# Altium schematic sheet MCU Power.SchDoc: MCU Power
size A4; SheetNumber: 4; SheetTotal: 5
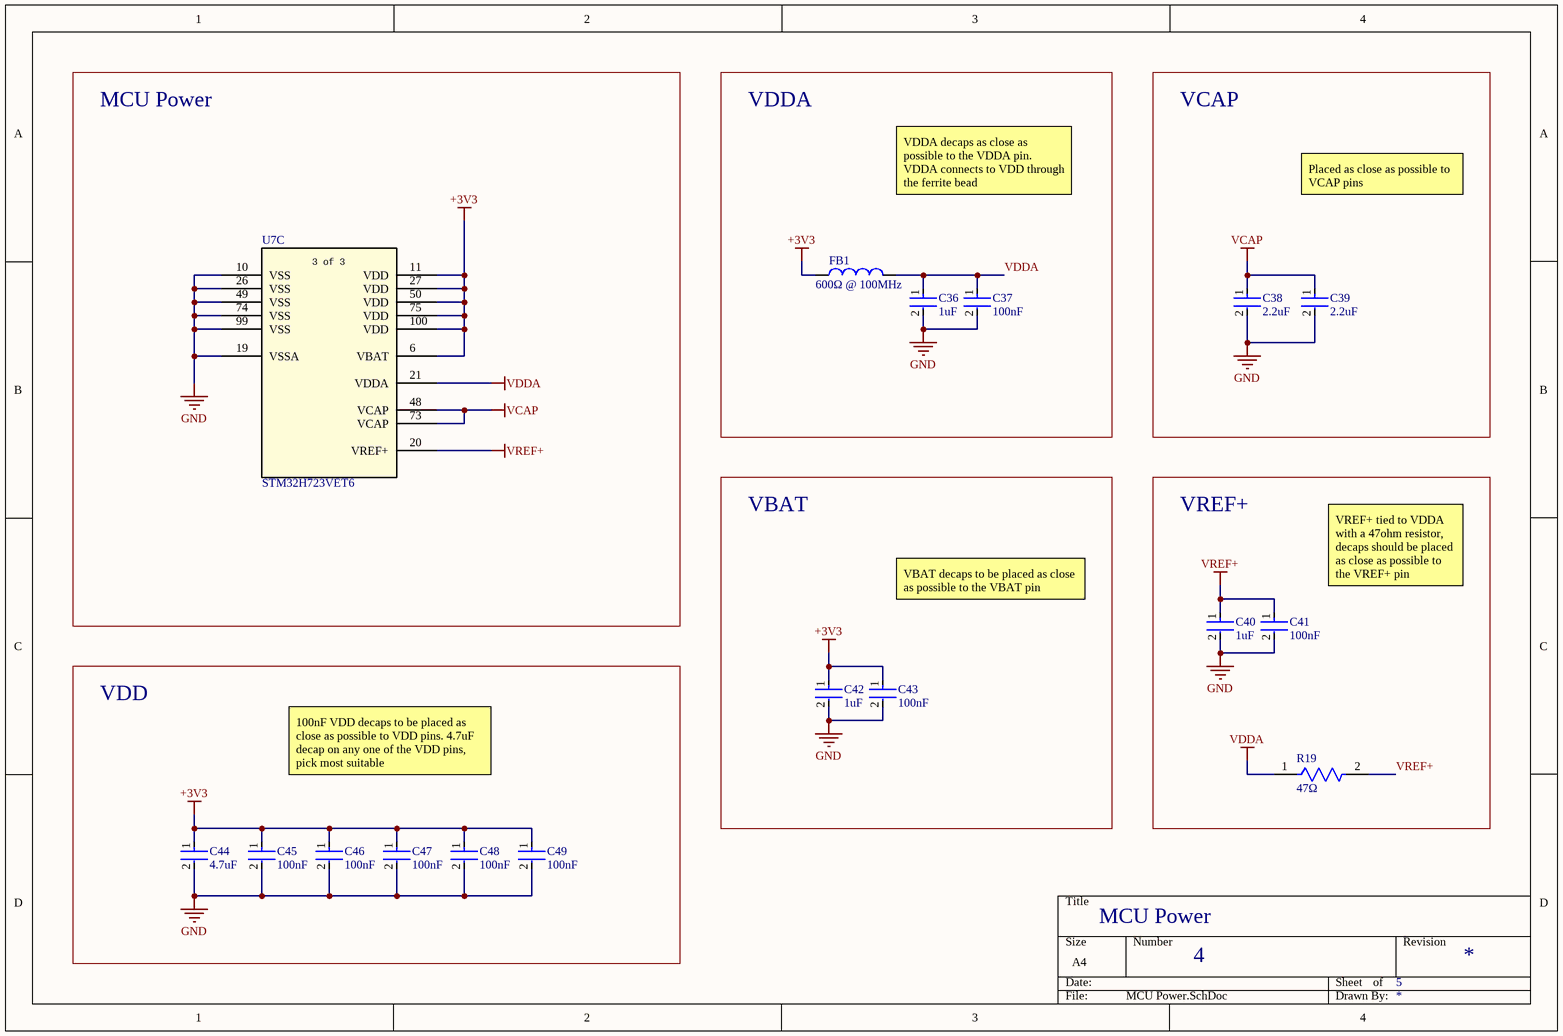
[diagram p0: MCU Power.SchDoc]

## Parts
C36  1uF  [FP-CC0603-DA-MFG]
C37  100nF  [FP-CC0603-DA-MFG]
C38  2.2uF  [FP-CL10-IPC_C]
C39  2.2uF  [FP-CL10-IPC_C]
C40  1uF  [FP-CC0603-DA-MFG]
C41  100nF  [FP-CC0603-DA-MFG]
C42  1uF  [FP-CC0603-DA-MFG]
C43  100nF  [FP-CC0603-DA-MFG]
C44  4.7uF  [FP-CC0603-DA-MFG]
C45  100nF  [FP-CC0603-DA-MFG]
C46  100nF  [FP-CC0603-DA-MFG]
C47  100nF  [FP-CC0603-DA-MFG]
C48  100nF  [FP-CC0603-DA-MFG]
C49  100nF  [FP-CC0603-DA-MFG]
FB1  600Ω @ 100MHz  [WE-MPSB_0805_L2W1.2H0.9]
R19  47Ω  [FP-RT0603-MFG]
U7  STM32H723VET6  [LQFP100_STM]  (part C of 3)

## Blocks framed on the sheet
MCU Power: U7
VDDA: C36 C37 FB1
VCAP: C38 C39
VBAT: C42 C43
VREF+: C40 C41 R19
VDD: C44-C49

## Nets
+3V3: C42.1 C43.1 C44.1 C45.1 C46.1 C47.1 C48.1 C49.1 FB1.1 U7.6(VBAT) U7.11(VDD) U7.27(VDD) U7.50(VDD) U7.75(VDD) U7.100(VDD)
GND: C36.2 C37.2 C38.2 C39.2 C40.2 C41.2 C42.2 C43.2 C44.2 C45.2 C46.2 C47.2 C48.2 C49.2 U7.10(VSS) U7.19(VSSA) U7.26(VSS) U7.49(VSS) U7.74(VSS) U7.99(VSS)
VCAP: C38.1 C39.1 U7.48(VCAP) U7.73(VCAP)
VDDA: C36.1 C37.1 FB1.2 R19.1 U7.21(VDDA)
VREF+: C40.1 C41.1 R19.2 U7.20(VREF+)

## Notes on the sheet
- VDDA decaps as close as possible to the VDDA pin. VDDA connects to VDD through the ferrite bead
- Placed as close as possible to VCAP pins
- VREF+ tied to VDDA with a 47ohm resistor, decaps should be placed as close as possible to the VREF+ pin
- VBAT decaps to be placed as close as possible to the VBAT pin
- 100nF VDD decaps to be placed as close as possible to VDD pins. 4.7uF decap on any one of the VDD pins, pick most suitable
- (in symbol STM32H723VET6, part C) 3 of 3

## Library data of the parts
C36 C40 C42 = CMP-2100-03598-2: CAP CER 1UF 25V X7R 0603; Manufacturer Part Number: CC0603KRX7R8BB105; Manufacturer: YAGEO; Tolerance: 0.1; Temperature Coefficient: 15%; Material: Ceramic; Value: 1 uF; ComponentLink2URL: http://www.yageo.com/documents/recent/UPY-GPHC_X7R_6.3V-to-50V_18.pdf; Temperature Range Low: -55°C; Temperature Range High: +125°C; Device Class L3: Ceramic Capacitors; Voltage: 25 V; Voltage Rating: 25 V; Capacitance: 1 uF; Mouser Description: 0603 1 uF 25 V ±10% Tolerance X7R SMT Multilayer Ceramic Capacitor; Footprint Url: http://www.yageo.com/exep/pages/download/literatures/UPY-C_GEN_24.pdf; Height: 0.9mm; Digikey Description: CAP CER 1UF 25V X7R 0603; Temperature: -55°C to +125°C; ComponentLink2Description: Datasheet; Device Class L2: Capacitors; Category: Cap; Lead Free: Yes; Octopart: https://octopart.com/cc0603krx7r8bb105-yageo-24490981; RoHS: TRUE; Package: CC0603-DA; Device Class L1: Passive Components; Temperature Characteristic: X7R; Automotive: No
C37 C41 C43 C45-C49 = CMP-03422-000081-1: CC0603 100 nF X7R 10.00% 25 V; Manufacturer Part Number: CC0603KPX7R8BB104; Manufacturer: YAGEO; Voltage: 25 V; Material: Ceramic; Tolerance: 0.1; Temperature Coefficient: 15%; Package: CC0603-DA; Capacitance: 100 nF; Device Class L2: Capacitors; Temperature Range High: +125°C; Automotive: No; Temperature Range Low: -55°C; Value: 100 nF; Device Class L1: Passive Components; Height: 0.9mm; RoHS: TRUE; Mouser Description: Multilayer Ceramic Capacitors MLCC - SMD/SMT 100nF 25V X7R 10%; Temperature Characteristic: X7R; Footprint Url: http://www.yageo.com/exep/pages/download/literatures/UPY-C_GEN_24.pdf; Octopart: https://octopart.com/cc0603kpx7r8bb104-yageo-12885111; Category: Cap; ComponentLink2Description: Datasheet; Voltage Rating: 25 V; Temperature: -55°C to +125°C; Device Class L3: Ceramic Capacitors; ComponentLink2URL: http://www.yageo.com/documents/recent/UPY-GPHC_X7R_6.3V-to-50V_18.pdf; Lead Free: Yes
C38 C39 = CMP-13271-002004-1: Cap Ceramic 2.2uF 6.3V X7R ±10% Pad SMD 0603 +125°C T/R; Mount: Surface Mount; Package Quantity: 1; Width: 0.031inch; Min Operating Temperature: -55°C; Length: 0.063inch; Max Operating Temperature: 125°C; Radiation Hardening: No; Height: 0.8mm; Dielectric: X7R; Depth: 0.8mm; Packaging: Tape and Reel; Case/Package: 0603; Capacitance: 2.2uF; Case Code (Imperial): 0603; Tolerance: 10%; Voltage Rating: 6.3V; Case Code (Metric): 1608; Thickness: 0.035inch
C44 = CMP-03422-001217-1: CAP CER 4.7UF 25V X5R 0603; Manufacturer: YAGEO; Manufacturer Part Number: CC0603KRX5R8BB475; Material: Ceramic; Temperature Coefficient: 15%; Tolerance: 0.1; Device Class L1: Passive Components; Temperature: -55°C to +125°C; Value: 4.7 uF; RoHS: TRUE; Temperature Range High: +125°C; Automotive: No; Lead Free: Yes; Digikey Description: CAP CER 4.7UF 25V X5R 0603; Category: Cap; Temperature Characteristic: X5R; Package: CC0603-DA; Device Class L2: Capacitors; Temperature Range Low: -55°C; Voltage Rating: 25 V; Capacitance: 4.7 uF; ComponentLink2URL: http://www.yageo.com/documents/recent/UPY-GPHC_X7R_6.3V-to-50V_18.pdf; Octopart: https://octopart.com/cc0603krx5r8bb475-yageo-77825350; Footprint Url: http://www.yageo.com/exep/pages/download/literatures/UPY-C_GEN_24.pdf; Device Class L3: Ceramic Capacitors; ComponentLink2Description: Datasheet; Voltage: 25 V; Height: 0.9mm
FB1 = CMP-03913-52738340-1: 74279220601 Ferrite Beads Multi-Layer High Current 600Ohm 25% 100MHz 2.1A 0.08Ohm DCR 0805 Automotive T/R; DC Resistance (DCR): 43mΩ; Number of Lines: 1; NexarPartId: 52738340; Current Rating: 2.1A; Termination: SMD/SMT; Max Current Rating: 2.1A; Min Operating Temperature: -55°C; Case Code (Imperial): 0805; Case Code (Metric): 2012; Case/Package: 0805; Packaging: Tape & Reel (TR); Impedance: 600Ω; Max Operating Temperature: 125°C; Height: 900µm; Test Frequency: 100MHz; REACH SVHC: Unknown; RoHS: Compliant; Width: 1.2mm; Weight: 5.499807mg; Length: 2mm; Tolerance: 25%; Max DC Current: 2.1A; Mount: Surface Mount
R19 = CMP-03412-031197-1: RES SMD 47 OHM 0.1% 1/10W 0603; Manufacturer: Yageo; Manufacturer Part Number: RT0603BRE0747RL; Tolerance: 0.001; Power Rating: 0.1W; Voltage Rating: 75V; Temperature Coefficient: 50 ppm/°C; Device Class L2: Resistors; Temperature Range High: +155°C; Series: RT; ComponentLink2URL: http://www.yageo.com/documents/recent/PYu-RT_1-to-0.01_RoHS_L_9.pdf; Composition: Thin Film; Lead Free: Yes; Automotive: No; RoHS: TRUE; Device Class L1: Passive Components; Category: Res; Resistance: 47Ω; Value: 47Ω; Temperature Range Low: -55°C; Footprint Url: http://www.yageo.com/exep/pages/download/literatures/PYu-R_Mount_10.pdf; Device Class L3: Chip SMD Resistors; Temperature: -55°C to +155°C; Octopart: https://octopart.com/rt0603bre0747rl-yageo-1447540; ComponentLink2Description: Datasheet; Package: RT0603; Ipc Land Pattern Name: RESC16080X45; Digikey Description: RES SMD 47 OHM 0.1% 1/10W 0603; Height: 0.55mm
U7 = STM32H723VET6: High-performance and DSP with DP-FPU, Arm Cortex-M7 MCU with 512 Kbytes Flash, 564 Kbytes RAM, 550 MHz CPU, L1 cache, external memory interface, subset of peripherals; Manufacturer_Name: STMicroelectronics; Copyright: Copyright (C) 2026 Ultra Librarian. All rights reserved.; Manufacturer_Part_Number: STM32H723VET6; RefDes: RefDes; Type: Type